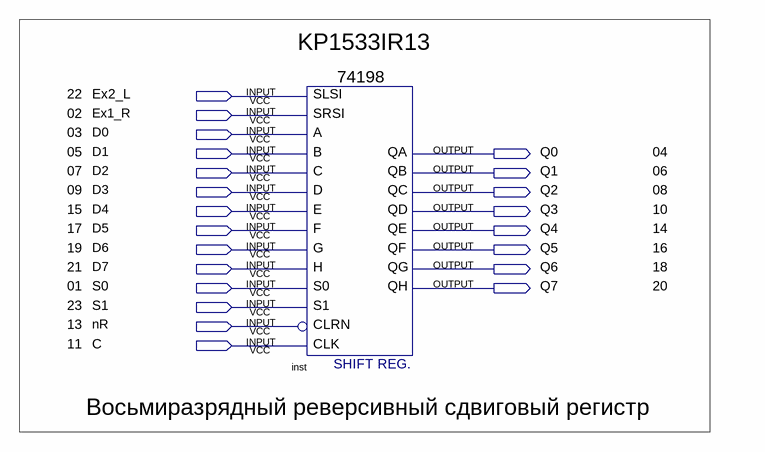
[diagram p0: schematic sheet]
// Quartus schematic KP1533IR13.bdf as structural Verilog: 1 symbols, 22 pins
module KP1533IR13 (
  input  Ex2_L,
  input  Ex1_R,
  input  D0,
  input  D1,
  input  D2,
  input  D3,
  input  D4,
  input  D5,
  input  D6,
  input  D7,
  input  S0,
  input  S1,
  input  nR,
  input  C,
  output Q0,
  output Q1,
  output Q2,
  output Q3,
  output Q4,
  output Q5,
  output Q6,
  output Q7
);

  \74198  inst (
    .A(D0), .SRSI(Ex1_R), .SLSI(Ex2_L), .E(D4), .S0(S0), .B(D1), .C(D2), .D(D3), .H(D7), .G(D6), .CLRN(nR),
    .CLK(C), .F(D5), .S1(S1), .QD(Q3), .QC(Q2), .QH(Q7), .QA(Q0), .QB(Q1), .QE(Q4), .QF(Q5), .QG(Q6));

  // Notes on the sheet:
  //   KP1533IR13
  //   22
  //   02
  //   03
  //   05
  //   04
  //   07
  //   06
  //   09
  //   08
  //   15
  //   10
  //   17
  //   14
  //   19
  //   16
  //   21
  //   18
  //   01
  //   20
  //   23
  //   13
  //   11
  //   Восьмиразрядный реверсивный сдвиговый регистр
endmodule
